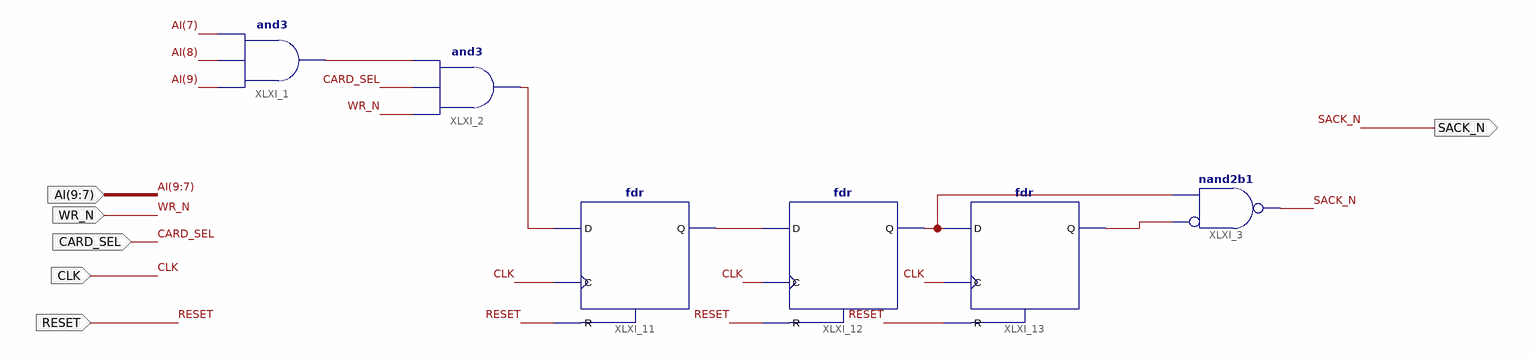
[diagram p0: schematic sheet 1]
// Xilinx ISE schematic slave_control.sch (spartan6) as structural Verilog: 6 symbols, 6 ports
module slave_control (
  input  CARD_SEL,
  input  WR_N,
  input  CLK,
  input  [9:7] AI,
  input  RESET,
  output SACK_N
);

  wire XLXN_1, XLXN_7, XLXN_9, XLXN_12, XLXN_20;

  and XLXI_2 (XLXN_7, WR_N, CARD_SEL, XLXN_1);
  nand XLXI_3 (SACK_N, ~XLXN_12, XLXN_20);  // nand2b1
  and XLXI_1 (XLXN_1, AI[9], AI[8], AI[7]);
  fdr XLXI_11 (.C(CLK), .D(XLXN_7), .R(RESET), .Q(XLXN_9));
  fdr XLXI_12 (.C(CLK), .D(XLXN_9), .R(RESET), .Q(XLXN_20));
  fdr XLXI_13 (.C(CLK), .D(XLXN_20), .R(RESET), .Q(XLXN_12));
endmodule
